# EAGLE schematic schematic2 (EAGLE 9.0.1)
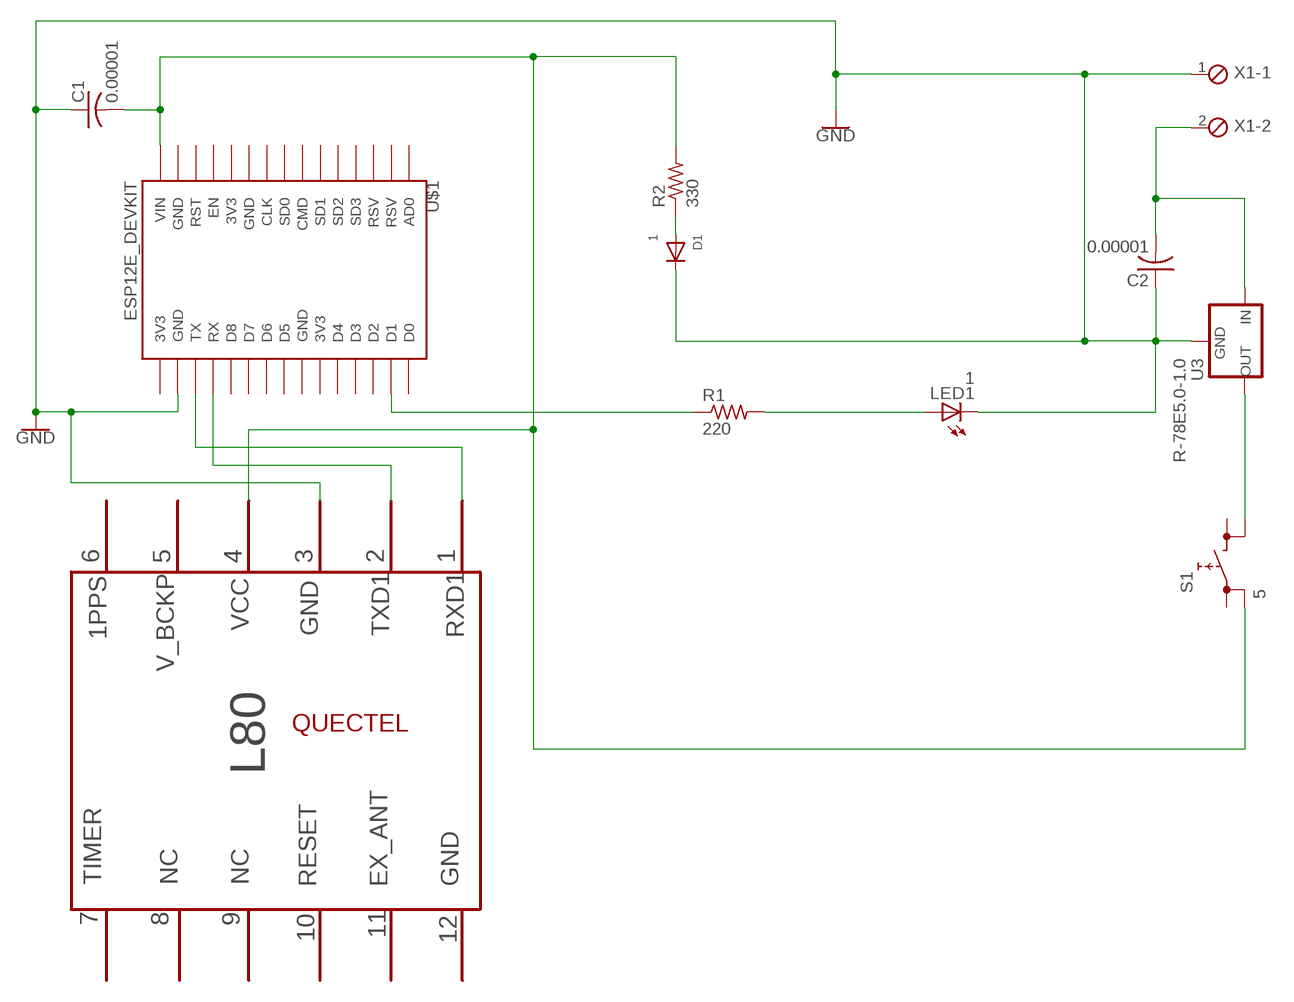
[diagram p0: schematic, sheet 1]

## Parts
C1  0.00001  C-USC0805  [C0805]
C2  0.00001  C-USC0805  [C0805]
D1  1  DIODEDO-1N4148  [DO-1N4148]
LED1  1  LEDCHIPLED_0805  [CHIPLED_0805]
R1  220  R-US_R0805  [R0805]
R2  330  R-US_R0805  [R0805]
S1  5  REKN  [REKN]
U3  R-78E5.0-1.0  [DC-DC_CONVERTER_78XX]
U$1  ESP12E_DEVKIT  [ESP12E_DEVKIT]
X1  MPT2  [2POL254]

## Nets
GND: C1.1 C2.1 D1.C LED1.C U3.GND U$1.GND@3(GND) X1.1
N$1: D1.A R2.1
N$2: C2.2 U3.VIN(IN) X1.2
N$3: S1.1B U3.VOUT(OUT)
N$4: R1.1 U$1.D1
N$6: C1.2 R2.2 S1.0B U$1.VIN
N$7: LED1.A R1.2
N$9: U$1.RX
N$10: U$1.TX
Unconnected: S1.0A S1.1A U$1.3V3@0(3V3) U$1.3V3@1(3V3) U$1.3V3@2(3V3) U$1.AD0 U$1.CLK U$1.CMD U$1.D0 U$1.D2 U$1.D3 U$1.D4 U$1.D5 U$1.D6 U$1.D7 U$1.D8 U$1.EN U$1.GND@0(GND) U$1.GND@1(GND) U$1.GND@2(GND) U$1.RST U$1.RSV@0(RSV) U$1.RSV@1(RSV) U$1.SD0 U$1.SD1 U$1.SD2 U$1.SD3

## Notes on the sheet
- 6 | 5 | 4 | 3 | 2 | 1
- VCC | GND | TXD1
- 1PPS | RXD1
- V_BCKP
- QUECTEL
- L80
- TIMER | NC | NC | RESET | EX_ANT | GND
- 7 | 8 | 9
- 10 | 11 | 12

## Library data of the parts
C1 C2 = adafruit:C-US: CAPACITOR, American symbol
D1 = adafruit:DIODE: Diode SMADIODE - SMA Surface Mount Package 20V 1A Schottky Diode Digikey: 641-1014-6-ND DO-1N4148 - Through Hole Small Current Diode SOD-123 20V 1 A (.5mV Vf) Schottky Diode - Digikey: MBRX120TPMSCT-ND SOD-323 10V 570mA (.38mV Vf, 3ns) Schottky Diode - Digikey: ZLLS410CT-ND SOD-523 30V 30mA Schottky Diode (RB751S-40TE61) - Digikey: RB751S-40TE61CT-ND SOT23-R/W - SOT23 Package (R = Solder Paste/Reflow Ovens, W = Hand-Soldering) BAT54Film 40V 300mA - Digikey: 497-7162-1-ND
LED1 = adafruit:LED: LED OSRAM: - CHIPLED LG R971, LG N971, LY N971, LG Q971, LY Q971, LO R971, LY R971 LH N974, LH R974 LS Q976, LO Q976, LY Q976 LO Q996 - Hyper CHIPLED LW Q18S LB Q993, LB Q99A, LB R99A - SideLED LS A670, LO A670, LY A670, LG A670, LP A670 LB A673, LV A673, LT A673, LW A673 LH A674 LY A675 LS A676, LA A676, LO A676, LY A676, LW A676 LS A679, LY A679, LG A679 - Hyper Micro SIDELED® LS Y876, LA Y876, LO Y876, LY Y876 LT Y87S - SmartLED LW L88C, LW L88S LB L89C, LB L89S, LG L890 LS L89K, LO L89K, LY L89K LS L896, LA L896, LO L896, LY L896 - TOPLED LS T670, LO T670, LY T670, LG T670, LP T670 LSG T670, LSP T670, LSY T670, LOP T670, LYG T670 LG T671, LOG T671, LSG T671 LB T673, LV T673, LT T673, LW T673 LH T674 LS T676, LA T676, LO T676, LY T676, LB T676, LH T676, LSB T676, LW T676 LB T67C, LV T67C, LT T67C, LS T67K, LO T67K, LY T67K, LW E67C LS E67B, LA E67B, LO E67B, LY E67B, LB E67C, LV E67C, LT E67C LW T67C LS T679, LY T679, LG T679 LS T770, LO T770, LY T770, LG T770, LP T770 LB T773, LV T773, LT T773, LW T773 LH T774 LS E675, LA E675, LY E675, LS T675 LS T776, LA T776, LO T776, LY T776, LB T776 LHGB T686 LT T68C, LB T68C - Hyper Mini TOPLED® LB M676 - Mini TOPLED Santana® LG M470 LS M47K, LO M47K, LY M47K Source: http://www.osram.convergy.de/
R1 R2 = adafruit:R-US_: RESISTOR, American symbol
S1 = switch:REKN: PUSH SWITCH ITT-Cannon-Cannon
U3 = SparkFun-IC-Power:R-78E5.0-1.0: Recom Power 5V 1A DC/DC Converter The Recom R-78E5.0-X.X is a compact DC/DC converter module that is a pin for pin drop-in replacement for the LM7805 linear voltage regulator. Specifications: Input Range: 7-28V Output Voltage: 5V Output Current: 1A Max Efficiency: 91% Datasheet <https://www.recom-power.com/pdf/Innoline/R-78Exx-1.0.pdf>; PROD_ID: COM-13655
U$1 = ESP12E_DEVKIT:ESP12E_DEVKIT: ESP12E DEVKIT BOARD
X1 = con-phoenix-254:MPT2: PHOENIX CONNECTOR; OC_FARNELL: unknown; OC_NEWARK: unknown